# Altium project RX.PrjPcb
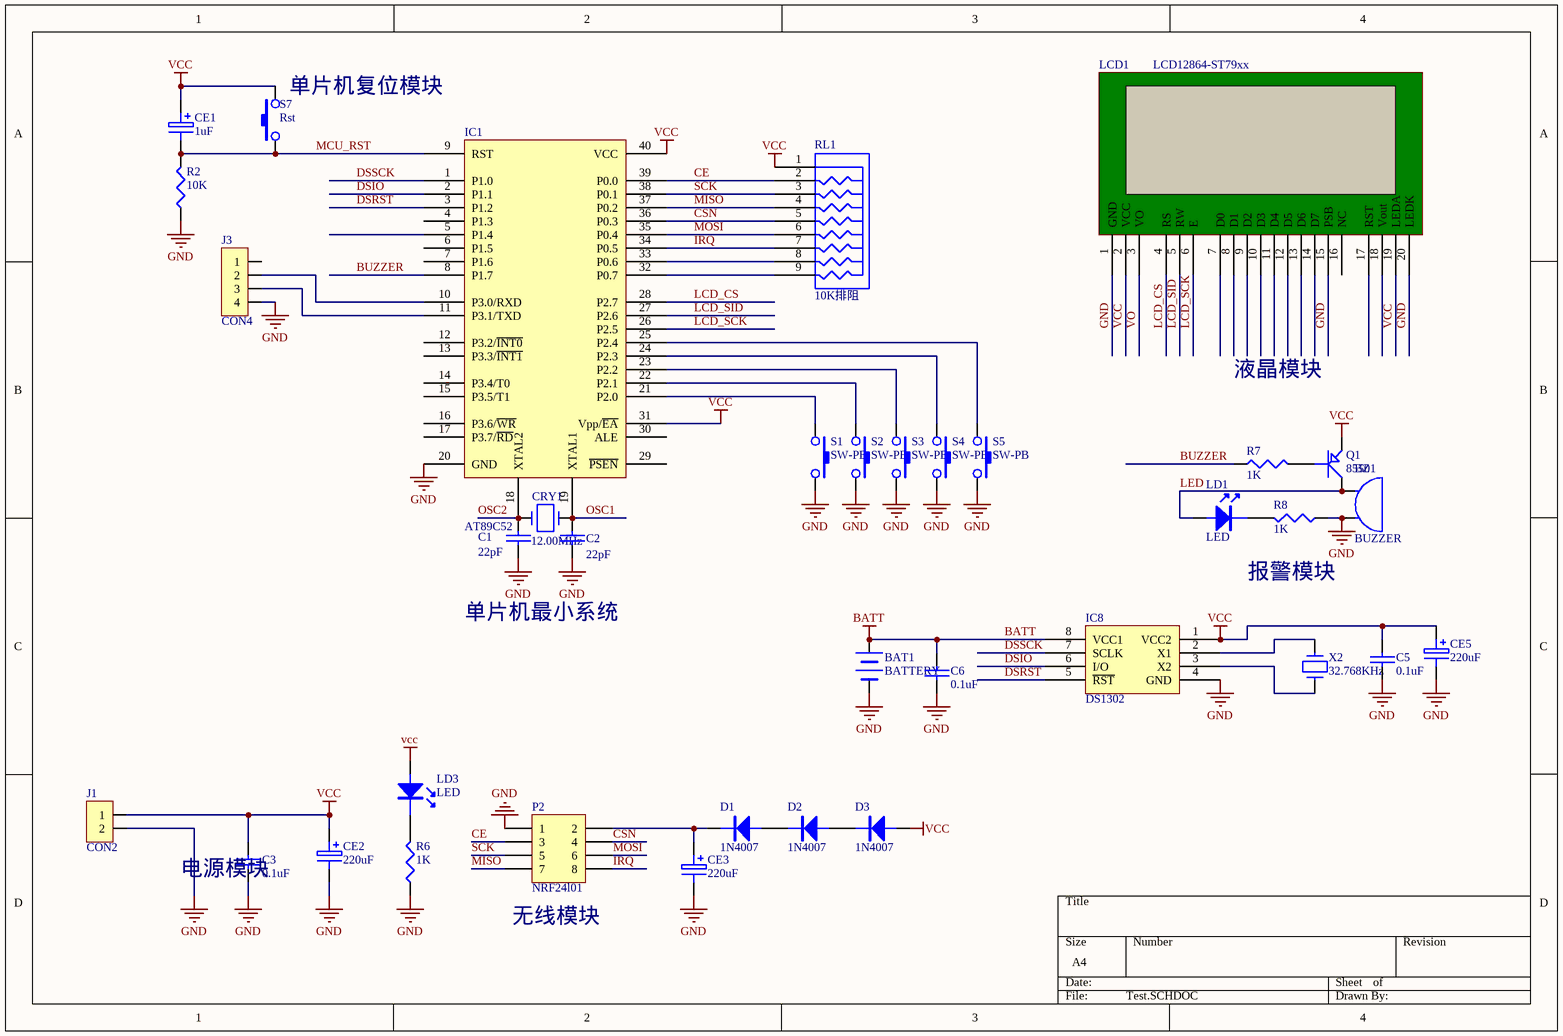
[diagram p0: Test.SCHDOC]
1 sheet, 36 parts. Net scope: global (net labels, ports and power ports of the same name join across sheets).
Board file: Test.PcbDoc

## Sheet Test.SCHDOC
size A4

### Parts
BAT1  BATTERY  [CR2032]
BZ1  BUZZER  [BUZZER1]
C1  22pF  [RAD0.1]
C2  22pF  [RAD0.1]
C3  0.1uF  [RAD0.1]
C5  0.1uF  [RAD0.1]
C6  0.1uF  [RAD0.1]
CE1  1uF  [RB.1/.1]
CE2  220uF  [RB.1/.2]
CE3  220uF  [RB.1/.2]
CE5  220uF  [RB.1/.2]
CRY1  12.00MHz  [XTAL1]
D1  1N4007  [DIODE0.3]
D2  1N4007  [DIODE0.3]
D3  1N4007  [DIODE0.3]
IC1  AT89C52  [DIP40]
IC8  DS1302  [DIP8]
J1  CON2  [HJ2P2.54]
J3  CON4  [SIP4]
LCD1  LCD12864-ST79xx  [SIP20]
LD1  LED  [LED3F-R]
LD3  LED  [LED3F-R]
P2  NRF24l01  [HDR2.54-2X4]
Q1  8550  [TO-92B]
R2  10K  [AXIAL0.3]
R6  1K  [AXIAL0.3]
R7  1K  [AXIAL0.3]
R8  1K  [AXIAL0.3]
RL1  10K排阻  [RES9P]
S1  SW-PB  [SW-PB4DS]
S2  SW-PB  [SW-PB4DS]
S3  SW-PB  [SW-PB4DS]
S4  SW-PB  [SW-PB4DS]
S5  SW-PB  [SW-PB4DS]
S7  Rst  [SW-PB4DS]
X2  32.768KHz  [RAD0.1]

### Nets
BATT: BAT1.1 C6.1 IC8.8(VCC1)
GND: BAT1.2 BZ1.2 C1.2 C2.2 C3.2 C5.2 C6.2 CE2.2 CE3.2 CE5.2 IC1.20(GND) IC8.4(GND) J1.2 J3.4 LCD1.1(GND) LCD1.15(PSB) LCD1.20(LEDK) P2.1 R2.1 R6.1 R8.1 S1.1 S2.1 S3.1 S4.1 S5.1
VCC: C3.1 C5.1 CE1.1 CE2.1 CE5.1 D3.A IC1.31(Vpp/~{EA}) IC1.40(VCC) IC8.1(VCC2) J1.1 LCD1.2(VCC) LCD1.19(LEDA) LD3.A Q1.EMIT RL1.1 S7.1
BUZZER: IC1.8(P1.7) R7.1
CE: IC1.39(P0.0) P2.3 RL1.2
CSN: IC1.36(P0.3) P2.4 RL1.5
DSIO: IC1.2(P1.1) IC8.6(I/O)
DSRST: IC1.3(P1.2) IC8.5(~{RST})
DSSCK: IC1.1(P1.0) IC8.7(SCLK)
IRQ: IC1.34(P0.5) P2.8 RL1.7
LCD_CS: IC1.28(P2.7) LCD1.4(RS)
LCD_SCK: IC1.26(P2.5) LCD1.6(E)
LCD_SID: IC1.27(P2.6) LCD1.5(RW)
LED: BZ1.1 LD1.A Q1.COLL
MCU_RST: CE1.2 IC1.9(RST) R2.2 S7.2
MISO: IC1.37(P0.2) P2.7 RL1.4
MOSI: IC1.35(P0.4) P2.6 RL1.6
OSC1: C2.1 CRY1.2 IC1.19(XTAL1)
OSC2: C1.1 CRY1.1 IC1.18(XTAL2)
SCK: IC1.38(P0.1) P2.5 RL1.3
VO: LCD1.3(VO)
NetCE3_1: CE3.1 D1.K P2.2
NetD1_A: D1.A D2.K
NetD2_A: D2.A D3.K
NetIC1_10: IC1.10(P3.0/RXD) J3.2
NetIC1_11: IC1.11(P3.1/TXD) J3.3
NetIC1_21: IC1.21(P2.0) S1.2
NetIC1_22: IC1.22(P2.1) S2.2
NetIC1_23: IC1.23(P2.2) S3.2
NetIC1_24: IC1.24(P2.3) S4.2
NetIC1_25: IC1.25(P2.4) S5.2
NetIC1_32: IC1.32(P0.7) RL1.9
NetIC1_33: IC1.33(P0.6) RL1.8
NetIC8_2: IC8.2(X1) X2.2
NetIC8_3: IC8.3(X2) X2.1
NetLD1_K: LD1.K R8.2
NetLD3_K: LD3.K R6.2
NetQ1_BASE: Q1.BASE R7.2

Not connected (* = marked no-connect by the designer): IC1 4(P1.3) 5(P1.4) 6(P1.5) 7(P1.6) 12(P3.2/~{INT0}) 13(P3.3/~{INT1}) 14(P3.4/T0) 15(P3.5/T1) 16(P3.6/~{WR}) 17(P3.7/~{RD}) 29(~{PSEN}) 30(ALE); J3 1; LCD1 7(D0) 8(D1) 9(D2) 10(D3) 11(D4) 12(D5) 13(D6) 14(D7) 16(NC) 17(RST) 18(Vout)

### Notes on the sheet
- (near S7) 单片机复位模块
- 液晶模块
- 报警模块
- 单片机最小系统
- (near J1) 电源模块
- (near P2) 无线模块

### Library data of the parts
C1 C2 = CAP: Capacitor
C3 C5 C6 = CAP
CE1-CE3 CE5 = ELECTRO1
CRY1 X2 = CRYSTAL
D1-D3 = DIODE
IC1 = AT89C51
P2 = Header 4X2: Header, 4-Pin, Dual row; LatestRevisionDate: 17-Jul-2002; LatestRevisionNote: Re-released for DXP Platform.; Publisher: Altium Limited
Q1 = PNP1
R2 R6-R8 = RES1
RL1 = RESL1
S7 = SW-PB